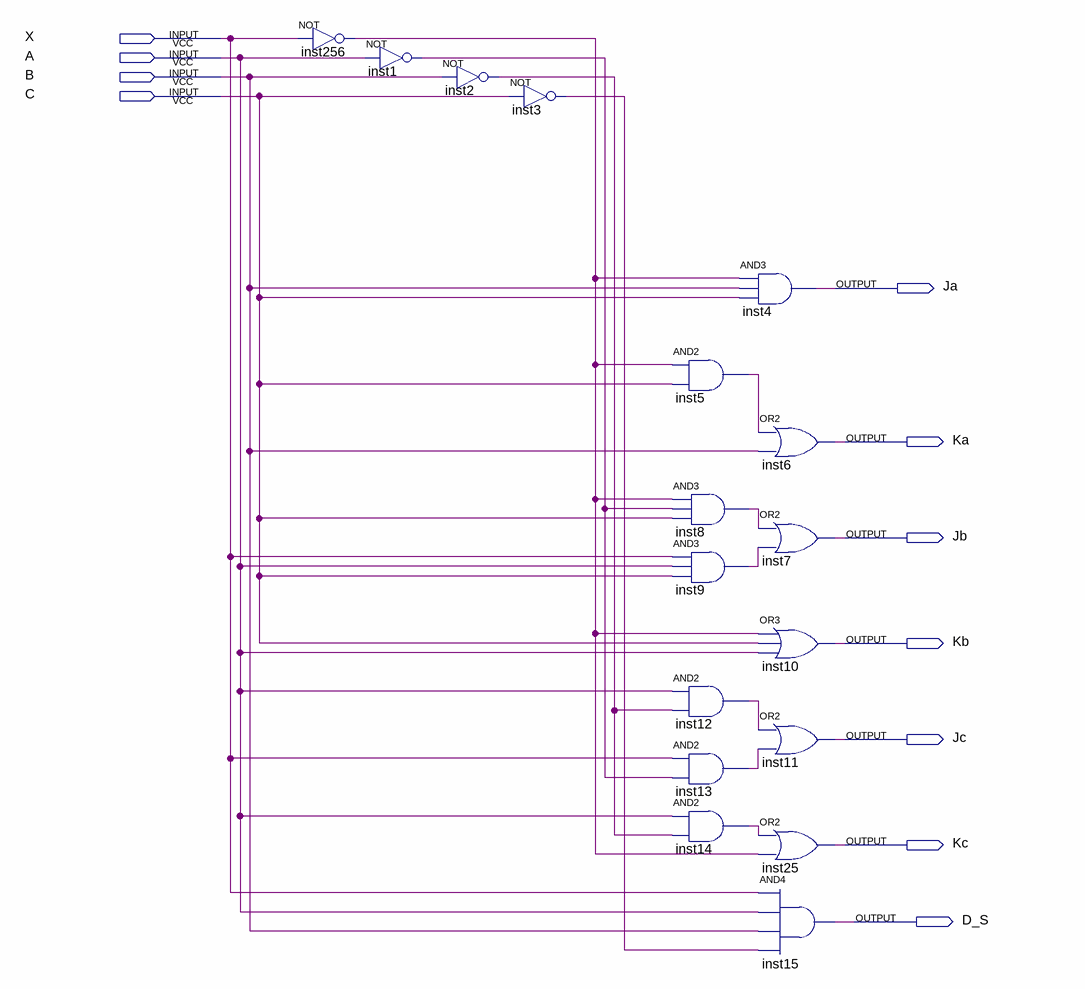
[diagram p0: schematic sheet]
// Quartus schematic Dec53.bdf as structural Verilog: 17 symbols, 11 pins
module Dec53 (
  input  X,
  input  A,
  input  B,
  input  C,
  output Ja,
  output Ka,
  output Jb,
  output Kb,
  output Jc,
  output Kc,
  output D_S
);

  wire inst1_out, inst2_out, inst3_out, inst5_out, inst8_out, inst9_out, inst12_out, inst13_out, inst14_out,
       inst256_out;

  not inst256 (inst256_out, X);
  not inst1 (inst1_out, A);
  not inst2 (inst2_out, B);
  not inst3 (inst3_out, C);
  and inst5 (inst5_out, inst256_out, C);
  and inst8 (inst8_out, inst256_out, inst1_out, C);
  and inst9 (inst9_out, X, A, C);
  and inst12 (inst12_out, A, inst2_out);
  and inst13 (inst13_out, X, inst1_out);
  and inst14 (inst14_out, A, inst2_out);
  and inst4 (Ja, inst256_out, B, C);
  or inst6 (Ka, inst5_out, B);
  or inst7 (Jb, inst8_out, inst9_out);
  or inst10 (Kb, inst256_out, C, A);
  or inst11 (Jc, inst12_out, inst13_out);
  or inst25 (Kc, inst14_out, inst256_out);
  and inst15 (D_S, X, A, B, inst3_out);
endmodule
